# Altium project ALU_Logic.PrjPcb
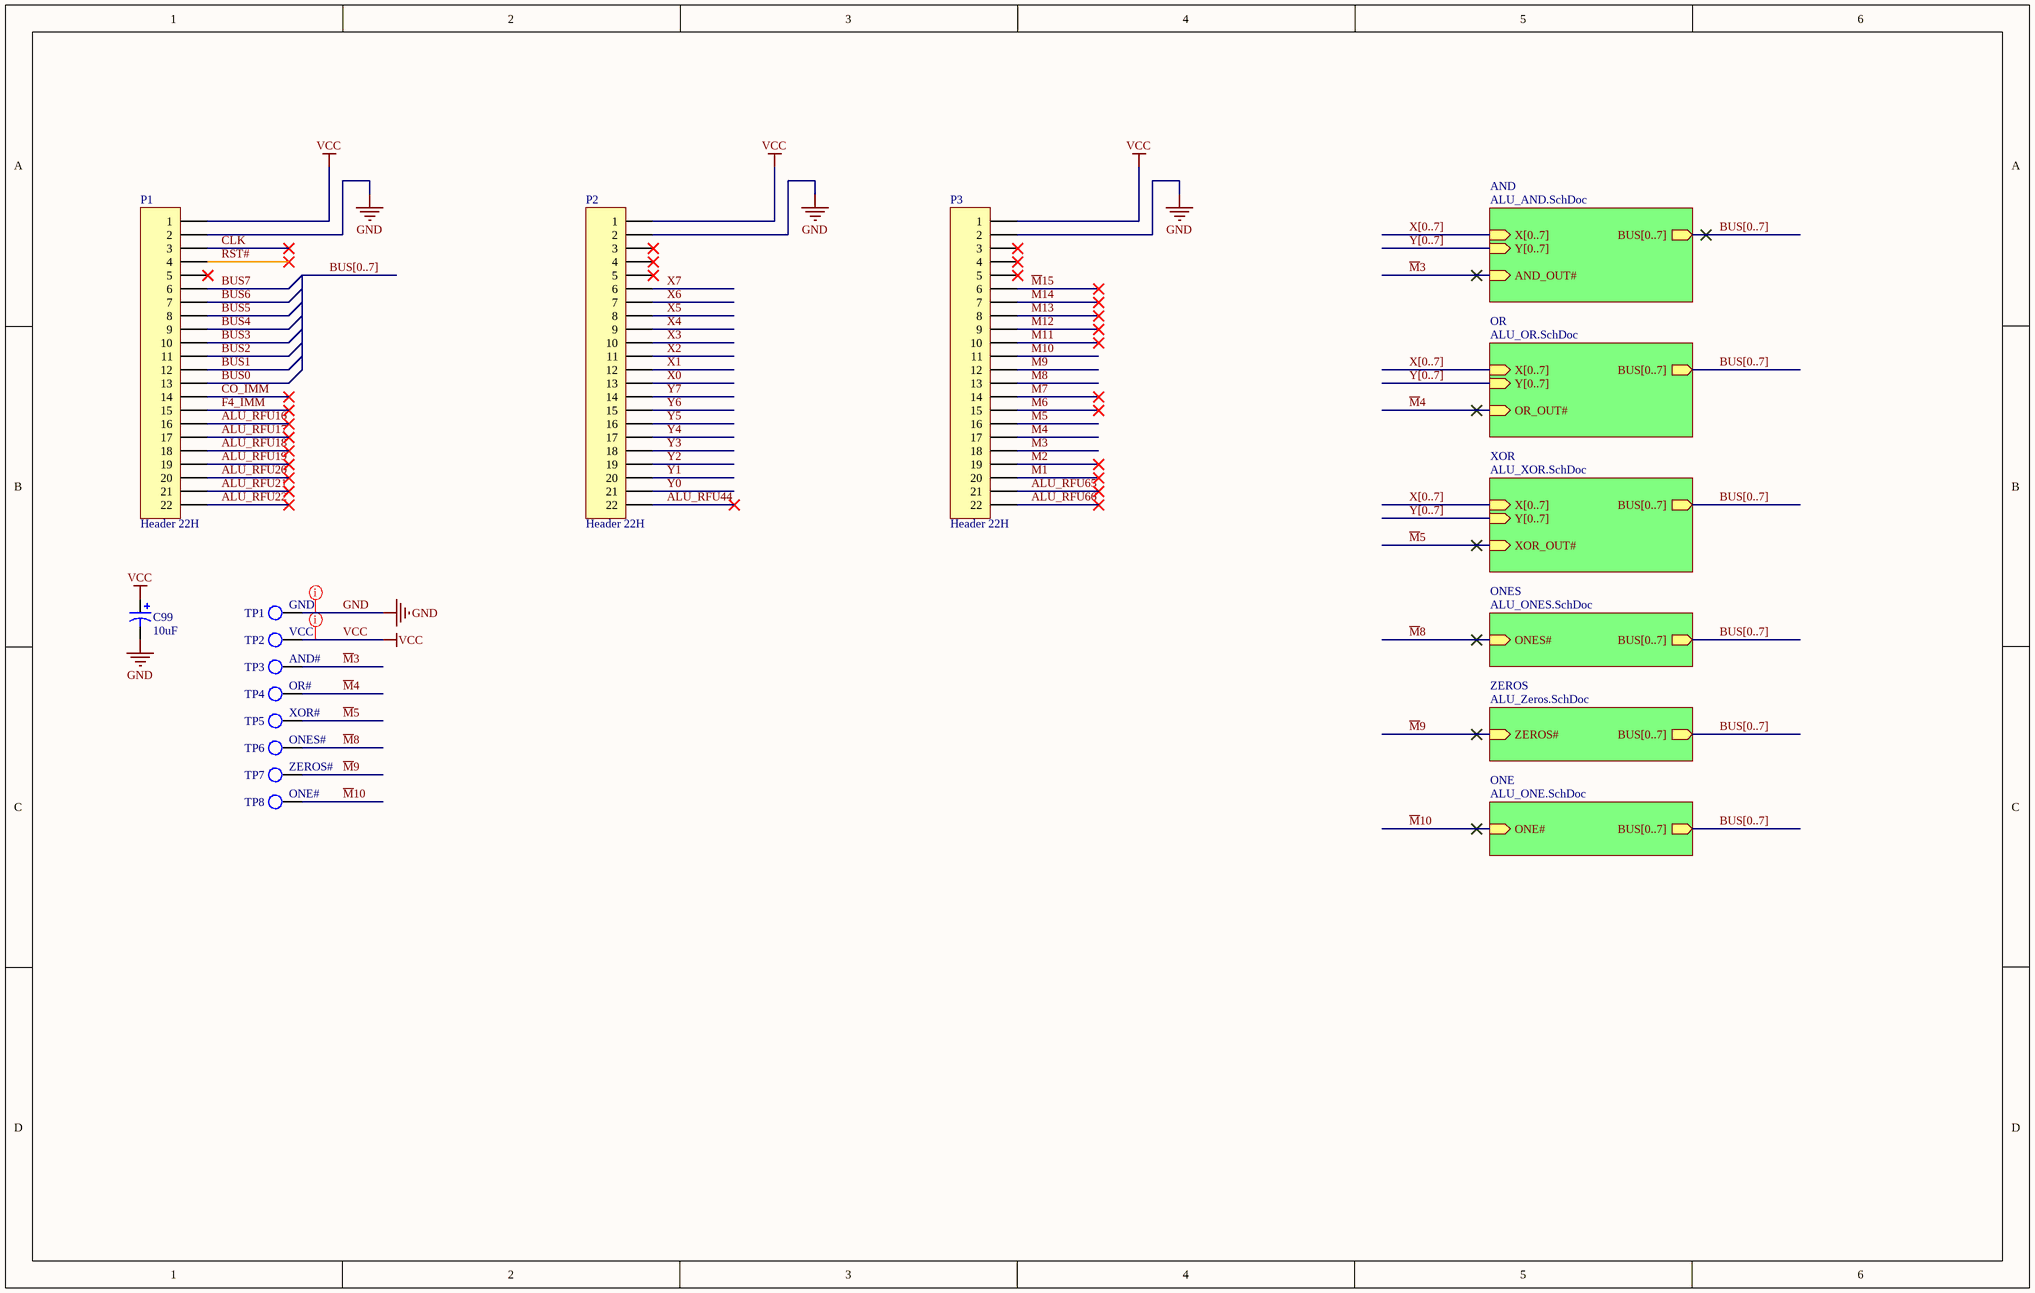
[diagram p0: ALU_Logic.SchDoc]
5 sheets, 32 parts. Net scope: hierarchical (ports join the sheet entries above them; power ports are global).
Board file: ALU_Logic.PcbDoc
Sheets:
  ALU_Logic.SchDoc
    AND = ALU_AND.SchDoc
    OR = ALU_OR.SchDoc
    XOR = ALU_XOR.SchDoc
    ONE = ALU_ONE.SchDoc

## Sheet ALU_Logic.SchDoc
size B; Author: E. Sims; Organization: Let's Build Rockets Inc.; SheetNumber: 1; SheetTotal: 7

### Parts
C99  value 10uF  [C5x7]  (hidden comment: Cap Pol5)
P1  Header 22H  [HDR1X22H]
P2  Header 22H  [HDR1X22H]
P3  Header 22H  [HDR1X22H]
TP1  GND  [KSTN-5011_V]  (no BOM)
TP2  VCC  [KSTN-5011_V]  (no BOM)
TP3  AND#  [KSTN-5011_V]  (no BOM)
TP4  OR#  [KSTN-5011_V]  (no BOM)
TP5  XOR#  [KSTN-5011_V]  (no BOM)
TP6  ONES#  [KSTN-5011_V]  (no BOM)
TP7  ZEROS#  [KSTN-5011_V]  (no BOM)
TP8  ONE#  [KSTN-5011_V]  (no BOM)

### Sub-sheets
AND = ALU_AND.SchDoc: X[0..7] (in), Y[0..7] (in), BUS[0..7] (out), AND_OUT# (in)
ONE = ALU_ONE.SchDoc: BUS[0..7] (out), ONE# (in)
ONES = ALU_ONES.SchDoc (file not in this document): BUS[0..7] (out), ONES# (in)
OR = ALU_OR.SchDoc: X[0..7] (in), Y[0..7] (in), BUS[0..7] (out), OR_OUT# (in)
XOR = ALU_XOR.SchDoc: X[0..7] (in), Y[0..7] (in), BUS[0..7] (out), XOR_OUT# (in)
ZEROS = ALU_Zeros.SchDoc (file not in this document): BUS[0..7] (out), ZEROS# (in)

### Nets
GND: C99.2 P1.2 P2.2 P3.2 TP1.1
VCC: C99.1 P1.1 P2.1 P3.1 TP2.1
ALU_RFU16: P1.16
ALU_RFU17: P1.17
ALU_RFU18: P1.18
ALU_RFU19: P1.19
ALU_RFU20: P1.20
ALU_RFU21: P1.21
ALU_RFU22: P1.22
ALU_RFU44: P2.22
ALU_RFU65: P3.21
ALU_RFU66: P3.22
BUS0: P1.13
BUS1: P1.12
BUS2: P1.11
BUS3: P1.10
BUS4: P1.9
BUS5: P1.8
BUS6: P1.7
BUS7: P1.6
CLK: P1.3
CO_IMM: P1.14
F4_IMM: P1.15
~{M}1: P3.20
~{M}2: P3.19
~{M}3: P3.18 TP3.1 ; sheet AND/AND_OUT#  [project net AND_OUT#]
~{M}4: P3.17 TP4.1 ; sheet OR/OR_OUT#
~{M}5: P3.16 TP5.1 ; sheet XOR/XOR_OUT#
~{M}6: P3.15
~{M}7: P3.14
~{M}8: P3.13 TP6.1 ; sheet ONES/ONES#
~{M}9: P3.12 TP7.1 ; sheet ZEROS/ZEROS#
~{M}10: P3.11 TP8.1 ; sheet ONE/ONE#
~{M}11: P3.10
~{M}12: P3.9
~{M}13: P3.8
~{M}14: P3.7
~{M}15: P3.6
RST#: P1.4
X0: P2.13
X1: P2.12
X2: P2.11
X3: P2.10
X4: P2.9
X5: P2.8
X6: P2.7
X7: P2.6
Y0: P2.21
Y1: P2.20
Y2: P2.19
Y3: P2.18
Y4: P2.17
Y5: P2.16
Y6: P2.15
Y7: P2.14

Not connected (* = marked no-connect by the designer): P1 5*; P2 3* 4* 5*; P3 3* 4* 5*

### Buses and harness runs
bus BUS[0..7]
bus BUS[0..7] = sheet AND/BUS[0..7]
bus BUS[0..7] = sheet ONE/BUS[0..7]
bus BUS[0..7] = sheet ONES/BUS[0..7]
bus BUS[0..7] = sheet OR/BUS[0..7]
bus BUS[0..7] = sheet XOR/BUS[0..7]
bus BUS[0..7] = sheet ZEROS/BUS[0..7]
bus X[0..7] = sheet AND/X[0..7]
bus X[0..7] = sheet OR/X[0..7]
bus X[0..7] = sheet XOR/X[0..7]
bus Y[0..7] = sheet AND/Y[0..7]
bus Y[0..7] = sheet OR/Y[0..7]
bus Y[0..7] = sheet XOR/Y[0..7]

### Layout directives
rule Width Constraint [Pref Width = 20mil    Min Width = 20mil    Max Width = 50mil]; rule Routing Via Style [Pref Size = 35mil    Pref Hole Size = 20mil]; net class PWR: GND, VCC

### Notes on the sheet
- Let's Build Rocket's Inc. Modular Paylaod System Based on TMP-010 Rev
  For more information visit https://github.com/LetsBuildRockets/Modular-Payload-System
  This work is licensed under CC BY-NC 4.0. To view a copy of this license, visit https://creativecommons.org/licenses/by-nc/4.0
- Title
- Size:
- Date:
- Assembly Variant:
- B
- Number:
- Time:
- Revision:
- Sheet
- of
- Author:
- File:

### Library data of the parts
C99 = Cap Pol5: Polarized Capacitor; Published: 8-Jun-2000; LatestRevisionDate: 17-Jul-2002; LatestRevisionNote: Re-released for DXP Platform.; PackageReference: POLAR0.8; Publisher: Altium Limited; PackageDescription: Polarized Capacitor; 2 Leads
P1-P3 = Header 22H: Header, 22-Pin, Right Angle; System: Connector; LatestRevisionDate: 17-Jul-2002; LatestRevisionNote: Re-released for DXP Platform.; Publisher: Altium Limited
TP1-TP8 = TP

## Sheet ALU_AND.SchDoc
size A; Author: E. Sims; Organization: Let's Build Rockets Inc.; SheetNumber: 2; SheetTotal: 8
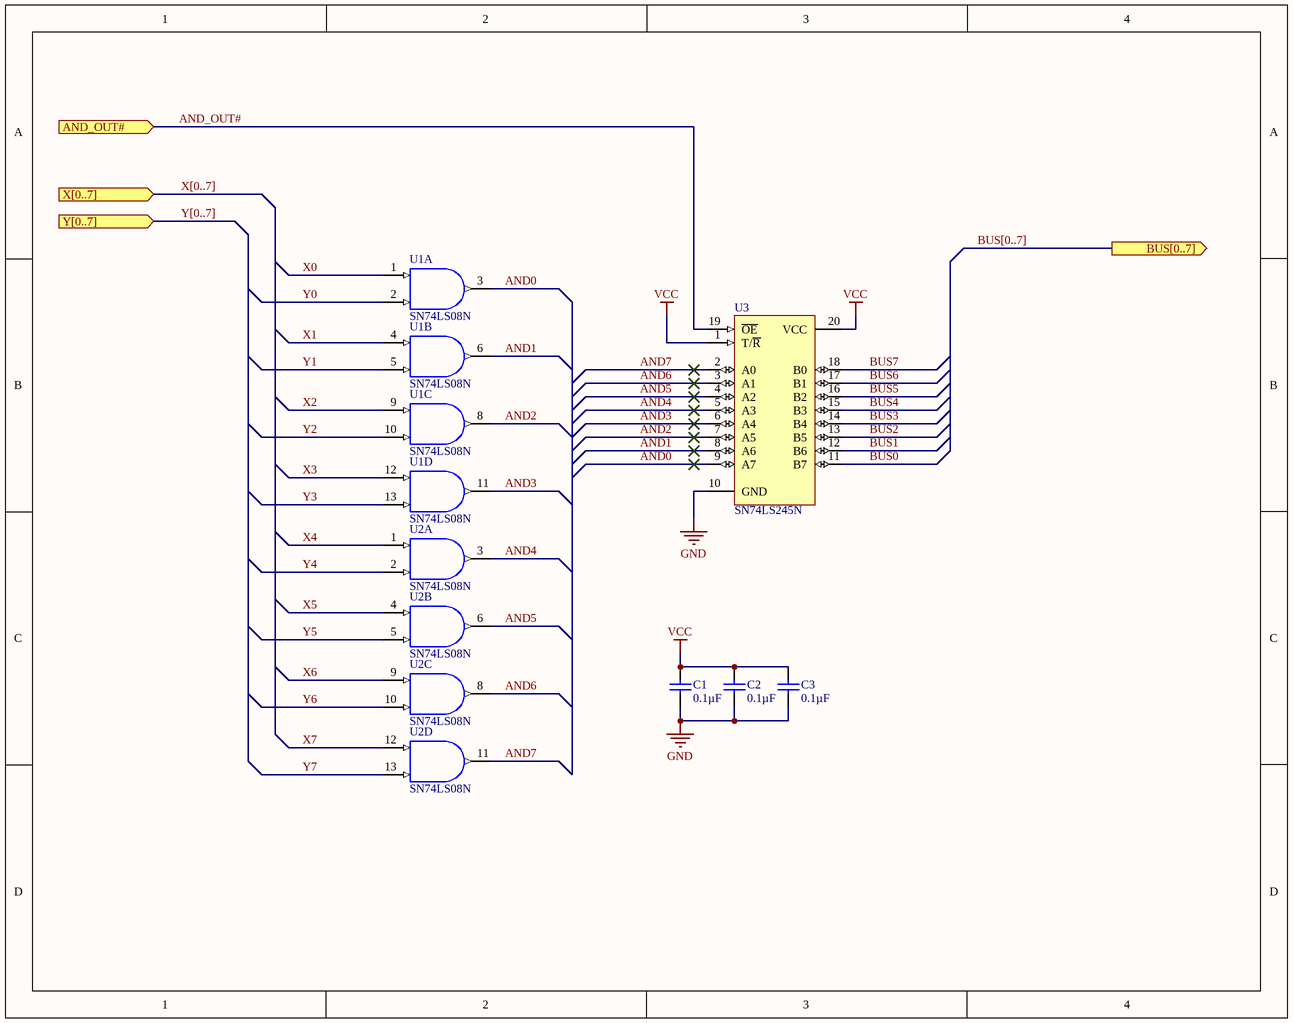
[diagram p1: ALU_AND.SchDoc]

### Parts
C1  Capacitance: 0.1µF  [VISH-K104K15X7RF5TL2]  (hidden comment: K104K15X7RF5TL2)
C2  Capacitance: 0.1µF  [VISH-K104K15X7RF5TL2]  (hidden comment: K104K15X7RF5TL2)
C3  Capacitance: 0.1µF  [VISH-K104K15X7RF5TL2]  (hidden comment: K104K15X7RF5TL2)
U1  SN74LS08N  [N014]  (parts A,B,C,D of 4)
U2  SN74LS08N  [N014]  (parts A,B,C,D of 4)
U3  SN74LS245N  [N020]

### Ports
AND_OUT# (in), BUS[0..7] (out), X[0..7] (in), Y[0..7] (in)

### Nets
GND: C1.2 C2.2 C3.2 U1.7(GND) U2.7(GND) U3.10(GND)
VCC: C1.1 C2.1 C3.1 U1.14(VCC) U2.14(VCC) U3.1(T/~{R}) U3.20(VCC)
AND0: U1.3(Y) U3.9(A7)
AND1: U1.6(Y) U3.8(A6)
AND2: U1.8(Y) U3.7(A5)
AND3: U1.11(Y) U3.6(A4)
AND4: U2.3(Y) U3.5(A3)
AND5: U2.6(Y) U3.4(A2)
AND6: U2.8(Y) U3.3(A1)
AND7: U2.11(Y) U3.2(A0)
AND_OUT#: U3.19(~{OE}) ; port AND_OUT#
BUS0: U3.11(B7)
BUS1: U3.12(B6)
BUS2: U3.13(B5)
BUS3: U3.14(B4)
BUS4: U3.15(B3)
BUS5: U3.16(B2)
BUS6: U3.17(B1)
BUS7: U3.18(B0)
X0: U1.1(A)
X1: U1.4(A)
X2: U1.9(A)
X3: U1.12(A)
X4: U2.1(A)
X5: U2.4(A)
X6: U2.9(A)
X7: U2.12(A)
Y0: U1.2(B)
Y1: U1.5(B)
Y2: U1.10(B)
Y3: U1.13(B)
Y4: U2.2(B)
Y5: U2.5(B)
Y6: U2.10(B)
Y7: U2.13(B)

### Buses and harness runs
bus BUS[0..7] = port BUS[0..7]
bus X[0..7] = port X[0..7]
bus Y[0..7] = port Y[0..7]

### Notes on the sheet
- Let's Build Rocket's Inc. Modular Paylaod System Based on TMP-010 Rev
  For more information visit https://github.com/LetsBuildRockets/Modular-Payload-System
  This work is licensed under CC BY-NC 4.0. To view a copy of this license, visit https://creativecommons.org/licenses/by-nc/4.0
- Title
- Size:
- Date:
- Assembly Variant:
- B
- Number:
- Time:
- Revision:
- Sheet
- of
- Author:
- File:

### Library data of the parts
C1-C3 = CMP-2000-06508-1: Ceramic Capacitor, 100 nF, +/- 10%, 50 V, -55 to 125 degC, 2-Pin THD, RoHS, Tape and Reel; Manufacturer: Vishay; Other Names: BC1084CT; Catalog Drawings: Mono-KapSide2-15_5.58Mono-KapSide1_15; Temperature Coefficient: X7R; Voltage - Rated: 50V; Online Catalog: Mono-Kap™Series; Size / Dimension: 0.157"Lx0.098"W(4.00mmx2.50mm); Operating Temperature: -55°C~125°C; Family: CeramicCapacitors; Manufacturer URL: http://www.vishay.com/; Standard Package: 1; Thickness (Max): -; Ratings: -; Datasheet Version: 08/2013; Package Description: 2-Pin Through Hole Device, Body 4 x 2.6 mm; Mounting Type: ThroughHole; Features: -; Lead Spacing: 0.098"(2.50mm); Tolerance: ±10%; Category: Capacitors; Mounting Technology: ThroughHole; Lead Style: Straight; Datasheet URL: http://www.vishay.com/docs/45171/kseries.pdf; Applications: GeneralPurpose; Package / Case: Radial; Height - Seated (Max): 0.220"(5.58mm); Package Reference: K104K15X7RF5TL2; Series: Mono-Kap™K; Packaging: CutTape(CT)
U1 U2 = SN74LS08N: Quadruple 2-Input Positive-AND Gate; Published: 8-Jun-2000; LatestRevisionDate: 04-Mar-2005; LatestRevisionNote: Stylized 3D Model Added.; DatasheetVersion: Mar-1988; PackageVersion: Oct-1995; PackageReference: N014; Publisher: Altium Limited; PackageDescription: DIP; 14 Leads; Row Spacing 7.62 mm; Pitch 2.54 mm; ComponentLink1Description: Manufacturer Link; ComponentLink1URL: http://www.ti.com/; ComponentLink2Description: Datasheet; ComponentLink2URL: http://www-s.ti.com/sc/ds/SN74LS08.pdf
U3 = SN74LS245N: Octal Bus Transceiver with 3-State Outputs; Published: 8-Jun-2000; LatestRevisionDate: 04-Mar-2005; LatestRevisionNote: Stylized 3D Model Added.; DatasheetVersion: Mar-1988; PackageVersion: Oct-1995; PackageReference: N020; Publisher: Altium Limited; PackageDescription: DIP; 20 Leads; Row Spacing 7.62 mm; Pitch 2.54 mm; ComponentLink1Description: Manufacturer Link; ComponentLink1URL: http://www.ti.com/; ComponentLink2Description: Datasheet; ComponentLink2URL: http://www-s.ti.com/sc/ds/sn74ls245.pdf

## Sheet ALU_OR.SchDoc
size A; Author: E. Sims; Organization: Let's Build Rockets Inc.; SheetNumber: 3; SheetTotal: 7
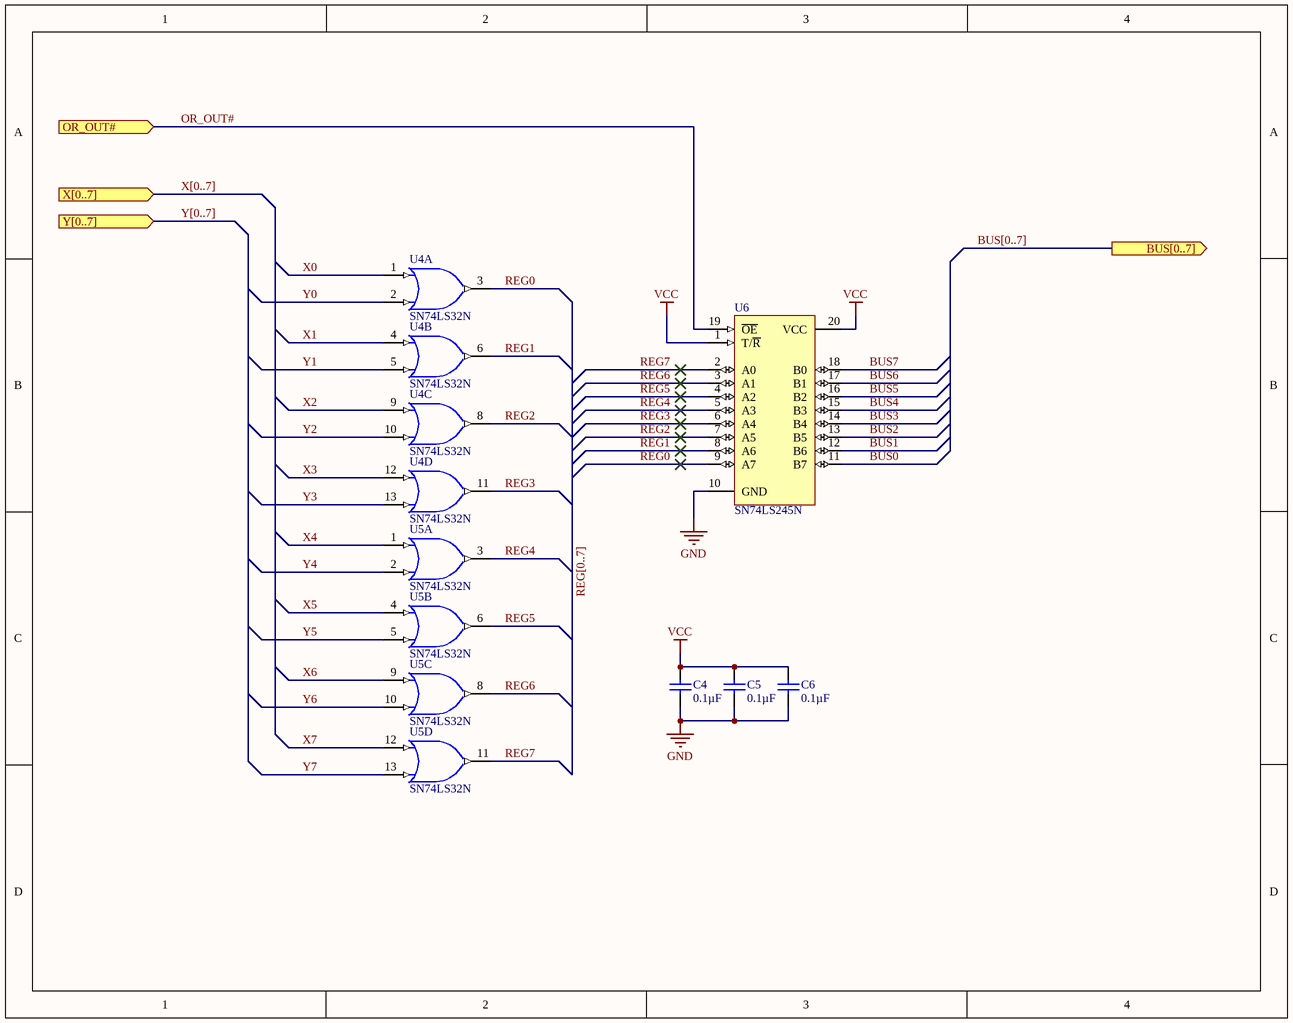
[diagram p2: ALU_OR.SchDoc]

### Parts
C4  Capacitance: 0.1µF  [VISH-K104K15X7RF5TL2]  (hidden comment: K104K15X7RF5TL2)
C5  Capacitance: 0.1µF  [VISH-K104K15X7RF5TL2]  (hidden comment: K104K15X7RF5TL2)
C6  Capacitance: 0.1µF  [VISH-K104K15X7RF5TL2]  (hidden comment: K104K15X7RF5TL2)
U4  SN74LS32N  [N014]  (parts A,B,C,D of 4)
U5  SN74LS32N  [N014]  (parts A,B,C,D of 4)
U6  SN74LS245N  [N020]

### Ports
BUS[0..7] (out), OR_OUT# (in), X[0..7] (in), Y[0..7] (in)

### Nets
GND: C4.2 C5.2 C6.2 U4.7(GND) U5.7(GND) U6.10(GND)
VCC: C4.1 C5.1 C6.1 U4.14(VCC) U5.14(VCC) U6.1(T/~{R}) U6.20(VCC)
BUS0: U6.11(B7)
BUS1: U6.12(B6)
BUS2: U6.13(B5)
BUS3: U6.14(B4)
BUS4: U6.15(B3)
BUS5: U6.16(B2)
BUS6: U6.17(B1)
BUS7: U6.18(B0)
OR_OUT#: U6.19(~{OE}) ; port OR_OUT#  [project net ~{M}4]
REG0: U4.3(Y) U6.9(A7)
REG1: U4.6(Y) U6.8(A6)
REG2: U4.8(Y) U6.7(A5)
REG3: U4.11(Y) U6.6(A4)
REG4: U5.3(Y) U6.5(A3)
REG5: U5.6(Y) U6.4(A2)
REG6: U5.8(Y) U6.3(A1)
REG7: U5.11(Y) U6.2(A0)
X0: U4.1(A)
X1: U4.4(A)
X2: U4.9(A)
X3: U4.12(A)
X4: U5.1(A)
X5: U5.4(A)
X6: U5.9(A)
X7: U5.12(A)
Y0: U4.2(B)
Y1: U4.5(B)
Y2: U4.10(B)
Y3: U4.13(B)
Y4: U5.2(B)
Y5: U5.5(B)
Y6: U5.10(B)
Y7: U5.13(B)

### Buses and harness runs
bus BUS[0..7] = port BUS[0..7]
bus REG[0..7]
bus X[0..7] = port X[0..7]
bus Y[0..7] = port Y[0..7]

### Notes on the sheet
- Let's Build Rocket's Inc. Modular Paylaod System Based on TMP-010 Rev
  For more information visit https://github.com/LetsBuildRockets/Modular-Payload-System
  This work is licensed under CC BY-NC 4.0. To view a copy of this license, visit https://creativecommons.org/licenses/by-nc/4.0
- Title
- Size:
- Date:
- Assembly Variant:
- B
- Number:
- Time:
- Revision:
- Sheet
- of
- Author:
- File:

### Library data of the parts
C4-C6 = CMP-2000-06508-1: as C1 on sheet ALU_AND; Size / Dimension: 0.157"Lx0.098"W(4.00mmx2.50mm); Operating Temperature: -55°C~125°C; Family: CeramicCapacitors; Manufacturer URL: http://www.vishay.com/; Standard Package: 1; Thickness (Max): -; Ratings: -; Datasheet Version: 08/2013; Package Description: 2-Pin Through Hole Device, Body 4 x 2.6 mm; Mounting Type: ThroughHole; Features: -; Lead Spacing: 0.098"(2.50mm); Tolerance: ±10%; Category: Capacitors; Mounting Technology: ThroughHole; Lead Style: Straight; Datasheet URL: http://www.vishay.com/docs/45171/kseries.pdf; Applications: GeneralPurpose; Package / Case: Radial; Height - Seated (Max): 0.220"(5.58mm); Package Reference: K104K15X7RF5TL2; Series: Mono-Kap™K; Packaging: CutTape(CT)
U4 U5 = SN74LS32N: Quadruple 2-Input Positive-OR Gate; Published: 8-Jun-2000; LatestRevisionDate: 04-Mar-2005; LatestRevisionNote: Stylized 3D Model Added.; DatasheetVersion: Mar-1988; PackageVersion: Oct-1995; PackageReference: N014; Publisher: Altium Limited; PackageDescription: DIP; 14 Leads; Row Spacing 7.62 mm; Pitch 2.54 mm; ComponentLink1Description: Manufacturer Link; ComponentLink1URL: http://www.ti.com/; ComponentLink2Description: Datasheet; ComponentLink2URL: http://www-s.ti.com/sc/ds/sn74ls32.pdf
U6 = SN74LS245N: as U3 on sheet ALU_AND; Published: 8-Jun-2000; LatestRevisionDate: 04-Mar-2005; LatestRevisionNote: Stylized 3D Model Added.; DatasheetVersion: Mar-1988; PackageVersion: Oct-1995; PackageReference: N020; Publisher: Altium Limited; PackageDescription: DIP; 20 Leads; Row Spacing 7.62 mm; Pitch 2.54 mm; ComponentLink1Description: Manufacturer Link; ComponentLink1URL: http://www.ti.com/; ComponentLink2Description: Datasheet; ComponentLink2URL: http://www-s.ti.com/sc/ds/sn74ls245.pdf

## Sheet ALU_XOR.SchDoc
size A; Author: E. Sims; Organization: Let's Build Rockets Inc.; SheetNumber: 4; SheetTotal: 7
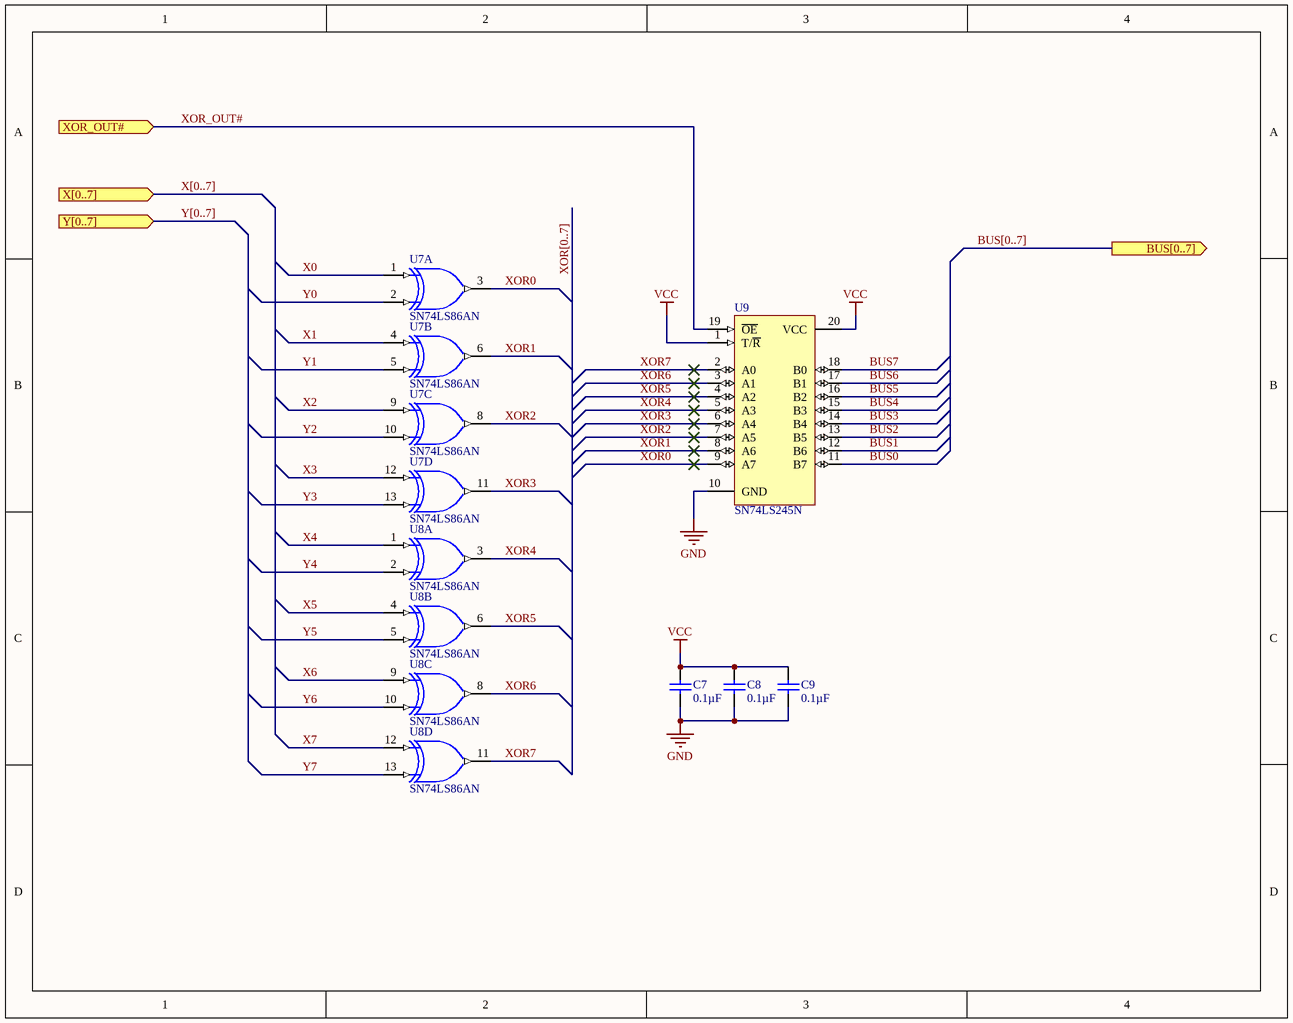
[diagram p3: ALU_XOR.SchDoc]

### Parts
C7  Capacitance: 0.1µF  [VISH-K104K15X7RF5TL2]  (hidden comment: K104K15X7RF5TL2)
C8  Capacitance: 0.1µF  [VISH-K104K15X7RF5TL2]  (hidden comment: K104K15X7RF5TL2)
C9  Capacitance: 0.1µF  [VISH-K104K15X7RF5TL2]  (hidden comment: K104K15X7RF5TL2)
U7  SN74LS86AN  [N014]  (parts A,B,C,D of 4)
U8  SN74LS86AN  [N014]  (parts A,B,C,D of 4)
U9  SN74LS245N  [N020]

### Ports
BUS[0..7] (out), X[0..7] (in), XOR_OUT# (in), Y[0..7] (in)

### Nets
GND: C7.2 C8.2 C9.2 U7.7(GND) U8.7(GND) U9.10(GND)
VCC: C7.1 C8.1 C9.1 U7.14(VCC) U8.14(VCC) U9.1(T/~{R}) U9.20(VCC)
BUS0: U9.11(B7)
BUS1: U9.12(B6)
BUS2: U9.13(B5)
BUS3: U9.14(B4)
BUS4: U9.15(B3)
BUS5: U9.16(B2)
BUS6: U9.17(B1)
BUS7: U9.18(B0)
X0: U7.1(A)
X1: U7.4(A)
X2: U7.9(A)
X3: U7.12(A)
X4: U8.1(A)
X5: U8.4(A)
X6: U8.9(A)
X7: U8.12(A)
XOR0: U7.3(Y) U9.9(A7)
XOR1: U7.6(Y) U9.8(A6)
XOR2: U7.8(Y) U9.7(A5)
XOR3: U7.11(Y) U9.6(A4)
XOR4: U8.3(Y) U9.5(A3)
XOR5: U8.6(Y) U9.4(A2)
XOR6: U8.8(Y) U9.3(A1)
XOR7: U8.11(Y) U9.2(A0)
XOR_OUT#: U9.19(~{OE}) ; port XOR_OUT#  [project net ~{M}5]
Y0: U7.2(B)
Y1: U7.5(B)
Y2: U7.10(B)
Y3: U7.13(B)
Y4: U8.2(B)
Y5: U8.5(B)
Y6: U8.10(B)
Y7: U8.13(B)

### Buses and harness runs
bus BUS[0..7] = port BUS[0..7]
bus X[0..7] = port X[0..7]
bus XOR[0..7]
bus Y[0..7] = port Y[0..7]

### Notes on the sheet
- Let's Build Rocket's Inc. Modular Paylaod System Based on TMP-010 Rev
  For more information visit https://github.com/LetsBuildRockets/Modular-Payload-System
  This work is licensed under CC BY-NC 4.0. To view a copy of this license, visit https://creativecommons.org/licenses/by-nc/4.0
- Title
- Size:
- Date:
- Assembly Variant:
- B
- Number:
- Time:
- Revision:
- Sheet
- of
- Author:
- File:

### Library data of the parts
C7-C9 = CMP-2000-06508-1: as C1 on sheet ALU_AND; Size / Dimension: 0.157"Lx0.098"W(4.00mmx2.50mm); Operating Temperature: -55°C~125°C; Family: CeramicCapacitors; Manufacturer URL: http://www.vishay.com/; Standard Package: 1; Thickness (Max): -; Ratings: -; Datasheet Version: 08/2013; Package Description: 2-Pin Through Hole Device, Body 4 x 2.6 mm; Mounting Type: ThroughHole; Features: -; Lead Spacing: 0.098"(2.50mm); Tolerance: ±10%; Category: Capacitors; Mounting Technology: ThroughHole; Lead Style: Straight; Datasheet URL: http://www.vishay.com/docs/45171/kseries.pdf; Applications: GeneralPurpose; Package / Case: Radial; Height - Seated (Max): 0.220"(5.58mm); Package Reference: K104K15X7RF5TL2; Series: Mono-Kap™K; Packaging: CutTape(CT)
U7 U8 = SN74LS86AN: Quadruple 2-Input Exclusive-OR Gate; Published: 8-Jun-2000; LatestRevisionDate: 04-Mar-2005; LatestRevisionNote: Stylized 3D Model Added.; DatasheetVersion: Mar-1988; PackageVersion: Oct-1995; PackageReference: N014; Publisher: Altium Limited; PackageDescription: DIP; 14 Leads; Row Spacing 7.62 mm; Pitch 2.54 mm; ComponentLink1Description: Manufacturer Link; ComponentLink1URL: http://www.ti.com/; ComponentLink2Description: Datasheet; ComponentLink2URL: http://www-s.ti.com/sc/ds/sn74ls86a.pdf
U9 = SN74LS245N: as U3 on sheet ALU_AND; Published: 8-Jun-2000; LatestRevisionDate: 04-Mar-2005; LatestRevisionNote: Stylized 3D Model Added.; DatasheetVersion: Mar-1988; PackageVersion: Oct-1995; PackageReference: N020; Publisher: Altium Limited; PackageDescription: DIP; 20 Leads; Row Spacing 7.62 mm; Pitch 2.54 mm; ComponentLink1Description: Manufacturer Link; ComponentLink1URL: http://www.ti.com/; ComponentLink2Description: Datasheet; ComponentLink2URL: http://www-s.ti.com/sc/ds/sn74ls245.pdf

## Sheet ALU_ONE.SchDoc
size A; Author: E. Sims; Organization: Let's Build Rockets Inc.; SheetNumber: 6; SheetTotal: 7
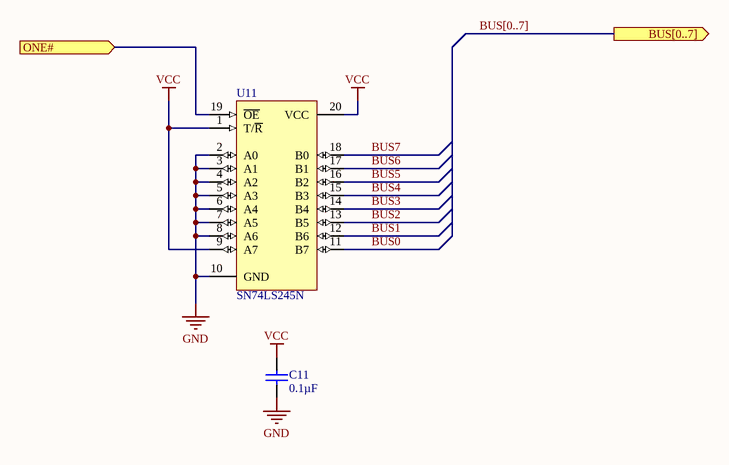
[diagram p4: ALU_ONE.SchDoc]

### Parts
C11  Capacitance: 0.1µF  [VISH-K104K15X7RF5TL2]  (hidden comment: K104K15X7RF5TL2)
U11  SN74LS245N  [N020]

### Ports
BUS[0..7] (out), ONE# (in)

### Nets
GND: C11.2 U11.2(A0) U11.3(A1) U11.4(A2) U11.5(A3) U11.6(A4) U11.7(A5) U11.8(A6) U11.10(GND)
VCC: C11.1 U11.1(T/~{R}) U11.9(A7) U11.20(VCC)
BUS0: U11.11(B7)
BUS1: U11.12(B6)
BUS2: U11.13(B5)
BUS3: U11.14(B4)
BUS4: U11.15(B3)
BUS5: U11.16(B2)
BUS6: U11.17(B1)
BUS7: U11.18(B0)
~{M}10: U11.19(~{OE}) ; port ONE#

### Buses and harness runs
bus BUS[0..7] = port BUS[0..7]

### Notes on the sheet
- Let's Build Rocket's Inc. Modular Paylaod System Based on TMP-010 Rev
  For more information visit https://github.com/LetsBuildRockets/Modular-Payload-System
  This work is licensed under CC BY-NC 4.0. To view a copy of this license, visit https://creativecommons.org/licenses/by-nc/4.0
- Title
- Size:
- Date:
- Assembly Variant:
- B
- Number:
- Time:
- Revision:
- Sheet
- of
- Author:
- File:

### Library data of the parts
C11 = CMP-2000-06508-1: as C1 on sheet ALU_AND; Size / Dimension: 0.157"Lx0.098"W(4.00mmx2.50mm); Operating Temperature: -55°C~125°C; Family: CeramicCapacitors; Manufacturer URL: http://www.vishay.com/; Standard Package: 1; Thickness (Max): -; Ratings: -; Datasheet Version: 08/2013; Package Description: 2-Pin Through Hole Device, Body 4 x 2.6 mm; Mounting Type: ThroughHole; Features: -; Lead Spacing: 0.098"(2.50mm); Tolerance: ±10%; Category: Capacitors; Mounting Technology: ThroughHole; Lead Style: Straight; Datasheet URL: http://www.vishay.com/docs/45171/kseries.pdf; Applications: GeneralPurpose; Package / Case: Radial; Height - Seated (Max): 0.220"(5.58mm); Package Reference: K104K15X7RF5TL2; Series: Mono-Kap™K; Packaging: CutTape(CT)
U11 = SN74LS245N: as U3 on sheet ALU_AND; Published: 8-Jun-2000; LatestRevisionDate: 04-Mar-2005; LatestRevisionNote: Stylized 3D Model Added.; DatasheetVersion: Mar-1988; PackageVersion: Oct-1995; PackageReference: N020; Publisher: Altium Limited; PackageDescription: DIP; 20 Leads; Row Spacing 7.62 mm; Pitch 2.54 mm; ComponentLink1Description: Manufacturer Link; ComponentLink1URL: http://www.ti.com/; ComponentLink2Description: Datasheet; ComponentLink2URL: http://www-s.ti.com/sc/ds/sn74ls245.pdf

## Nets that join several sheets
GND: ALU_Logic (5 pins), ALU_AND (6 pins), ALU_OR (6 pins), ALU_XOR (6 pins), ALU_ONE (9 pins)
VCC: ALU_Logic (5 pins), ALU_AND (7 pins), ALU_OR (7 pins), ALU_XOR (7 pins), ALU_ONE (C11.1 U11.1 U11.9 U11.20)
AND_OUT#: ALU_Logic (P3.18 TP3.1), ALU_AND (U3.19)
BUS0: ALU_Logic (P1.13), ALU_AND (U3.11), ALU_OR (U6.11), ALU_XOR (U9.11), ALU_ONE (U11.11)
BUS1: ALU_Logic (P1.12), ALU_AND (U3.12), ALU_OR (U6.12), ALU_XOR (U9.12), ALU_ONE (U11.12)
BUS2: ALU_Logic (P1.11), ALU_AND (U3.13), ALU_OR (U6.13), ALU_XOR (U9.13), ALU_ONE (U11.13)
BUS3: ALU_Logic (P1.10), ALU_AND (U3.14), ALU_OR (U6.14), ALU_XOR (U9.14), ALU_ONE (U11.14)
BUS4: ALU_Logic (P1.9), ALU_AND (U3.15), ALU_OR (U6.15), ALU_XOR (U9.15), ALU_ONE (U11.15)
BUS5: ALU_Logic (P1.8), ALU_AND (U3.16), ALU_OR (U6.16), ALU_XOR (U9.16), ALU_ONE (U11.16)
BUS6: ALU_Logic (P1.7), ALU_AND (U3.17), ALU_OR (U6.17), ALU_XOR (U9.17), ALU_ONE (U11.17)
BUS7: ALU_Logic (P1.6), ALU_AND (U3.18), ALU_OR (U6.18), ALU_XOR (U9.18), ALU_ONE (U11.18)
~{M}4: ALU_Logic (P3.17 TP4.1), ALU_OR (U6.19)
~{M}5: ALU_Logic (P3.16 TP5.1), ALU_XOR (U9.19)
~{M}10: ALU_Logic (P3.11 TP8.1), ALU_ONE (U11.19)
X0: ALU_Logic (P2.13), ALU_AND (U1.1), ALU_OR (U4.1), ALU_XOR (U7.1)
X1: ALU_Logic (P2.12), ALU_AND (U1.4), ALU_OR (U4.4), ALU_XOR (U7.4)
X2: ALU_Logic (P2.11), ALU_AND (U1.9), ALU_OR (U4.9), ALU_XOR (U7.9)
X3: ALU_Logic (P2.10), ALU_AND (U1.12), ALU_OR (U4.12), ALU_XOR (U7.12)
X4: ALU_Logic (P2.9), ALU_AND (U2.1), ALU_OR (U5.1), ALU_XOR (U8.1)
X5: ALU_Logic (P2.8), ALU_AND (U2.4), ALU_OR (U5.4), ALU_XOR (U8.4)
X6: ALU_Logic (P2.7), ALU_AND (U2.9), ALU_OR (U5.9), ALU_XOR (U8.9)
X7: ALU_Logic (P2.6), ALU_AND (U2.12), ALU_OR (U5.12), ALU_XOR (U8.12)
Y0: ALU_Logic (P2.21), ALU_AND (U1.2), ALU_OR (U4.2), ALU_XOR (U7.2)
Y1: ALU_Logic (P2.20), ALU_AND (U1.5), ALU_OR (U4.5), ALU_XOR (U7.5)
Y2: ALU_Logic (P2.19), ALU_AND (U1.10), ALU_OR (U4.10), ALU_XOR (U7.10)
Y3: ALU_Logic (P2.18), ALU_AND (U1.13), ALU_OR (U4.13), ALU_XOR (U7.13)
Y4: ALU_Logic (P2.17), ALU_AND (U2.2), ALU_OR (U5.2), ALU_XOR (U8.2)
Y5: ALU_Logic (P2.16), ALU_AND (U2.5), ALU_OR (U5.5), ALU_XOR (U8.5)
Y6: ALU_Logic (P2.15), ALU_AND (U2.10), ALU_OR (U5.10), ALU_XOR (U8.10)
Y7: ALU_Logic (P2.14), ALU_AND (U2.13), ALU_OR (U5.13), ALU_XOR (U8.13)